# EAGLE design MotorDriver (EAGLE 9.7.0)
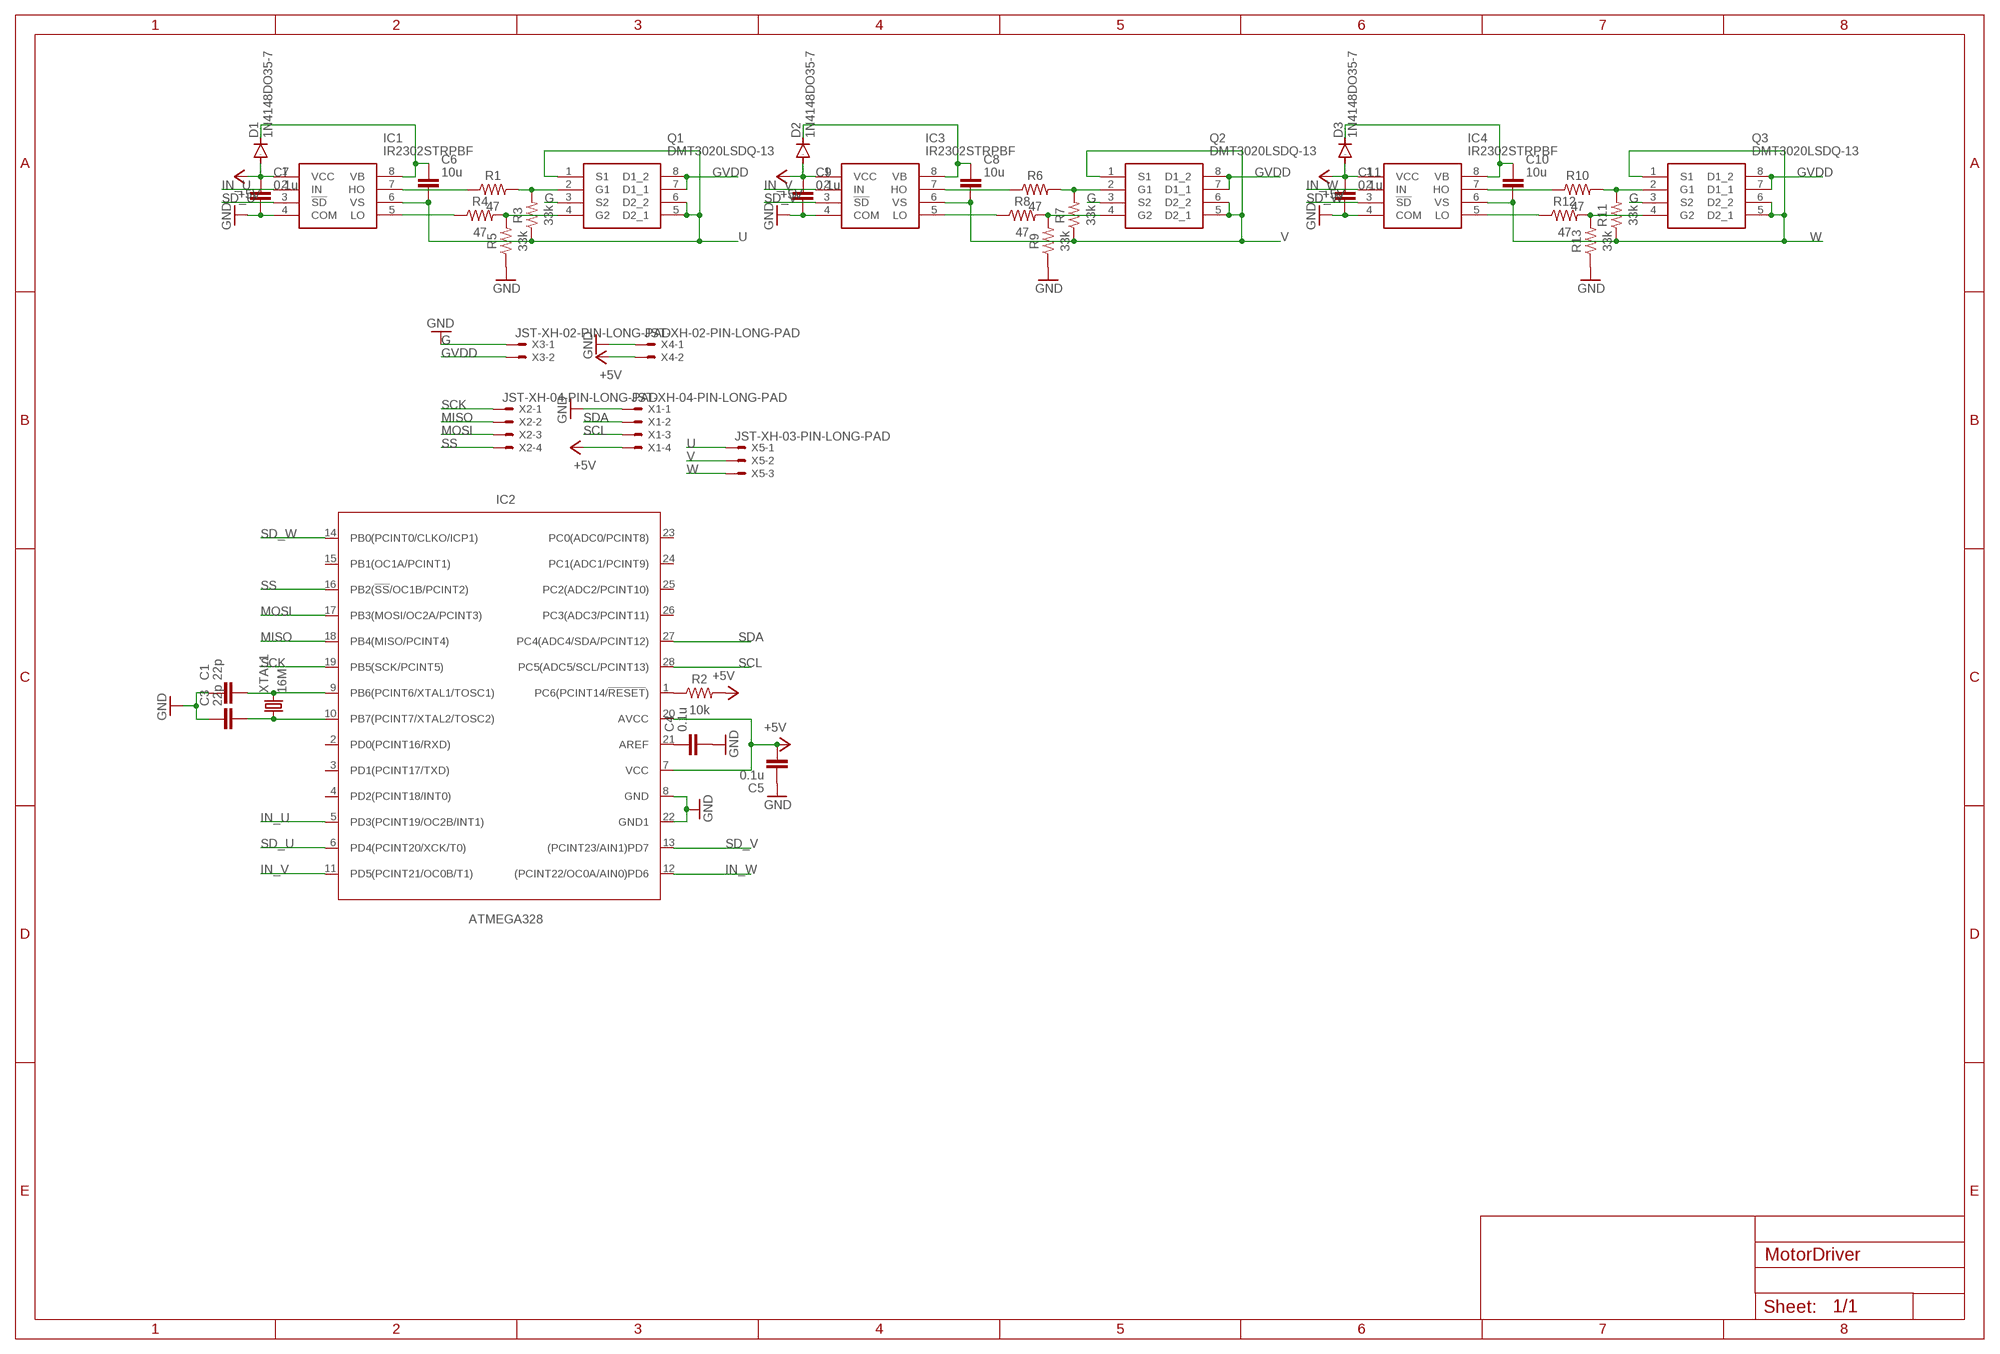
[diagram p0: schematic, sheet 1]

## Parts
C1  22p  C_CHIP-0603(1608-METRIC)  [CAPC1608X85]
C3  22p  C_CHIP-0603(1608-METRIC)  [CAPC1608X85]
C4  0.1u  C_CHIP-0603(1608-METRIC)  [CAPC1608X85]
C5  0.1u  C_CHIP-0603(1608-METRIC)  [CAPC1608X85]
C6  10u  C_CHIP-0603(1608-METRIC)  [CAPC1608X85]
C7  0.1u  C_CHIP-0603(1608-METRIC)  [CAPC1608X85]
C8  10u  C_CHIP-0603(1608-METRIC)  [CAPC1608X85]
C9  0.1u  C_CHIP-0603(1608-METRIC)  [CAPC1608X85]
C10  10u  C_CHIP-0603(1608-METRIC)  [CAPC1608X85]
C11  0.1u  C_CHIP-0603(1608-METRIC)  [CAPC1608X85]
D1  1N4148DO35-7  [DO35-7]
D2  1N4148DO35-7  [DO35-7]
D3  1N4148DO35-7  [DO35-7]
IC1  IR2302STRPBF  [SOIC127P600X175-8N]
IC2  ATMEGA328  ATMEGA328_DIP  [DIP1016W53P254L3467H457Q28B]
IC3  IR2302STRPBF  [SOIC127P600X175-8N]
IC4  IR2302STRPBF  [SOIC127P600X175-8N]
Q1  DMT3020LSDQ-13  [SOIC127P600X170-8N]
Q2  DMT3020LSDQ-13  [SOIC127P600X170-8N]
Q3  DMT3020LSDQ-13  [SOIC127P600X170-8N]
R1  47  R-US_CHIP-0603(1608-METRIC)  [RESC1608X60]
R2  10k  R-US_CHIP-0603(1608-METRIC)  [RESC1608X60]
R3  33k  R-US_CHIP-0603(1608-METRIC)  [RESC1608X60]
R4  47  R-US_CHIP-0603(1608-METRIC)  [RESC1608X60]
R5  33k  R-US_CHIP-0603(1608-METRIC)  [RESC1608X60]
R6  47  R-US_CHIP-0603(1608-METRIC)  [RESC1608X60]
R7  33k  R-US_CHIP-0603(1608-METRIC)  [RESC1608X60]
R8  47  R-US_CHIP-0603(1608-METRIC)  [RESC1608X60]
R9  33k  R-US_CHIP-0603(1608-METRIC)  [RESC1608X60]
R10  47  R-US_CHIP-0603(1608-METRIC)  [RESC1608X60]
R11  33k  R-US_CHIP-0603(1608-METRIC)  [RESC1608X60]
R12  47  R-US_CHIP-0603(1608-METRIC)  [RESC1608X60]
R13  33k  R-US_CHIP-0603(1608-METRIC)  [RESC1608X60]
X1  JST-XH-04-PIN-LONG-PAD  [JST-XH-04-PACKAGE-LONG-PAD]
X2  JST-XH-04-PIN-LONG-PAD  [JST-XH-04-PACKAGE-LONG-PAD]
X3  JST-XH-02-PIN-LONG-PAD  [JST-XH-02-PACKAGE-LONG-PAD]
X4  JST-XH-02-PIN-LONG-PAD  [JST-XH-02-PACKAGE-LONG-PAD]
X5  JST-XH-03-PIN-LONG-PAD  [JST-XH-03-PACKAGE-LONG-PAD]
XTAL1  16M  CRYSTAL_HC49-11.5L  [XTALRR488W45L1150T500H350B]

## Nets
+5V: C5.2 C7.1 C9.1 C11.1 D1.A D2.A D3.A IC1.1(VCC) IC2.7(VCC) IC2.20(AVCC) IC3.1(VCC) IC4.1(VCC) R2.2 X1.4 X4.2
G [power]: Q1.3(S2) Q2.3(S2) Q3.3(S2) X3.1 ; supply symbol labelled GND
GND: C1.1 C3.1 C4.2 C5.1 C7.2 C9.2 C11.2 IC1.4(COM) IC2.8(GND) IC2.22(GND1) IC3.4(COM) IC4.4(COM) R5.1 R9.1 R13.1 X1.1 X4.1
GVDD [power]: Q1.7(D1_1) Q1.8(D1_2) Q2.7(D1_1) Q2.8(D1_2) Q3.7(D1_1) Q3.8(D1_2) X3.2
IN_U: IC1.2(IN) IC2.5(PD3(PCINT19/OC2B/INT1))
IN_V: IC2.11(PD5(PCINT21/OC0B/T1)) IC3.2(IN)
IN_W: IC2.12((PCINT22/OC0A/AIN0)PD6) IC4.2(IN)
MISO: IC2.18(PB4(MISO/PCINT4)) X2.2
MOSI: IC2.17(PB3(MOSI/OC2A/PCINT3)) X2.3
N$1: C1.2 IC2.9(PB6(PCINT6/XTAL1/TOSC1)) XTAL1.2
N$2: C3.2 IC2.10(PB7(PCINT7/XTAL2/TOSC2)) XTAL1.1
N$3: IC2.1(PC6(PCINT14/!RESET!)) R2.1
N$4: C4.1 IC2.21(AREF)
N$5: C6.1 D1.C IC1.8(VB)
N$7: IC1.7(HO) R1.1
N$8: Q1.2(G1) R1.2 R3.2
N$9: Q1.4(G2) R4.2 R5.2
N$10: IC1.5(LO) R4.1
N$11: C8.1 D2.C IC3.8(VB)
N$13: IC3.7(HO) R6.1
N$14: Q2.2(G1) R6.2 R7.2
N$15: Q2.4(G2) R8.2 R9.2
N$16: IC3.5(LO) R8.1
N$17: C10.1 D3.C IC4.8(VB)
N$19: IC4.7(HO) R10.1
N$20: Q3.2(G1) R10.2 R11.2
N$21: Q3.4(G2) R12.2 R13.2
N$22: IC4.5(LO) R12.1
SCK: IC2.19(PB5(SCK/PCINT5)) X2.1
SCL: IC2.28(PC5(ADC5/SCL/PCINT13)) X1.3
SD_U: IC1.3(!SD) IC2.6(PD4(PCINT20/XCK/T0))
SD_V: IC2.13((PCINT23/AIN1)PD7) IC3.3(!SD)
SD_W: IC2.14(PB0(PCINT0/CLKO/ICP1)) IC4.3(!SD)
SDA: IC2.27(PC4(ADC4/SDA/PCINT12)) X1.2
SS: IC2.16(PB2(!SS!/OC1B/PCINT2)) X2.4
U [motor]: C6.2 IC1.6(VS) Q1.1(S1) Q1.5(D2_1) Q1.6(D2_2) R3.1 X5.1
V [motor]: C8.2 IC3.6(VS) Q2.1(S1) Q2.5(D2_1) Q2.6(D2_2) R7.1 X5.2
W [motor]: C10.2 IC4.6(VS) Q3.1(S1) Q3.5(D2_1) Q3.6(D2_2) R11.1 X5.3
Unconnected: IC2.2(PD0(PCINT16/RXD)) IC2.3(PD1(PCINT17/TXD)) IC2.4(PD2(PCINT18/INT0)) IC2.15(PB1(OC1A/PCINT1)) IC2.23(PC0(ADC0/PCINT8)) IC2.24(PC1(ADC1/PCINT9)) IC2.25(PC2(ADC2/PCINT10)) IC2.26(PC3(ADC3/PCINT11))

## Library data of the parts
C1 C3-C11 = Capacitor:C: Capacitor - Generic; CATEGORY: Capacitor
D1-D3 = diode:1N4148: DIODE high speed (Philips)
IC1 IC3 IC4 = IR2302STRPBF:IR2302STRPBF: Gate Drivers Hlf Brdg Drvr Soft T rn On Sngl 500ns Source: Datasheet <https://www.infineon.com/dgdl/Infineon-IR2302-DataSheet-v01_00-EN.pdf?fileId=5546d462533600a4015355c988b216de>; DESCRIPTION: Gate Drivers Hlf Brdg Drvr Soft T rn On Sngl 500ns; HEIGHT: 1.75mm; MANUFACTURER_NAME: Infineon; MANUFACTURER_PART_NUMBER: IR2302STRPBF; MOUSER_PART_NUMBER: 942-IR2302STRPBF; MOUSER_PRICE-STOCK: https://www.mouser.co.uk/ProductDetail/Infineon-IR/IR2302STRPBF?qs=2r01AXMCG3Pq9eYgEWJCIg%3D%3D
IC2 = IC_Embedded:ATMEGA328: 8-bit AVR Microcontroller with 32K Bytes In-System Programmable Flash Datasheet <http://ww1.microchip.com/downloads/en/DeviceDoc/ATmega48A-PA-88A-PA-168A-PA-328-P-DS-DS40002061A.pdf>; CATEGORY: IC_Embedded; MANUFACTURER: Microchip Technologies; MPN: ATmega328-PN; OPERATING_TEMP: –40 to +105°C; PART_STATUS: Active; SUB-CATEGORY: Microcontroller
Q1-Q3 = DMT3020LSDQ-13:DMT3020LSDQ-13: MOSFET MOSFET BVDSS: 8V 24V SO-8 T&R 2.5K Source: Datasheet <https://www.diodes.com/assets/Datasheets/DMT3020LSDQ.pdf>; DESCRIPTION: MOSFET MOSFET BVDSS: 8V 24V SO-8 T&R 2.5K; HEIGHT: 1.7mm; MANUFACTURER_NAME: Diodes Inc.; MANUFACTURER_PART_NUMBER: DMT3020LSDQ-13; MOUSER_PART_NUMBER: 621-DMT3020LSDQ-13; MOUSER_PRICE-STOCK: https://www.mouser.co.uk/ProductDetail/Diodes-Incorporated/DMT3020LSDQ-13?qs=Cb2nCFKsA8rthxKmUbYESA%3D%3D
R1-R13 = Resistor:R-US: Resistor Fixed - ANSI; CATEGORY: Resistor; SUB-CATEGORY: Fixed
X1 X2 = Rembrandt Electronics - JST XH Connectors v1-0:JST-XH-04-PIN: JST XH Connector 2 Pin Wire to board connector. Pitch: 2,54 mm, (0.100") Number of pins: 4 Created by Rembrandt Electronics www.rembrandtelectronics.com
X3 X4 = Rembrandt Electronics - JST XH Connectors v1-0:JST-XH-02-PIN: JST XH Connector 2 Pin Wire to board connector. Pitch: 2,54 mm, (0.100") Number of pins: 2 Created by Rembrandt Electronics www.rembrandtelectronics.com
X5 = Rembrandt Electronics - JST XH Connectors v1-0:JST-XH-03-PIN: JST XH Connector 2 Pin Wire to board connector. Pitch: 2,54 mm, (0.100") Number of pins: 3 Created by Rembrandt Electronics www.rembrandtelectronics.com
XTAL1 = Frequency-Source:CRYSTAL: Crystal 2Pin - Generic; CATEGORY: Frequency-Source; SUB-CATEGORY: Crystal-2Pin; VALUE: HC49

## Net classes
1 power: width 1.016 mm
2 motor: width 0.762 mm

## Board
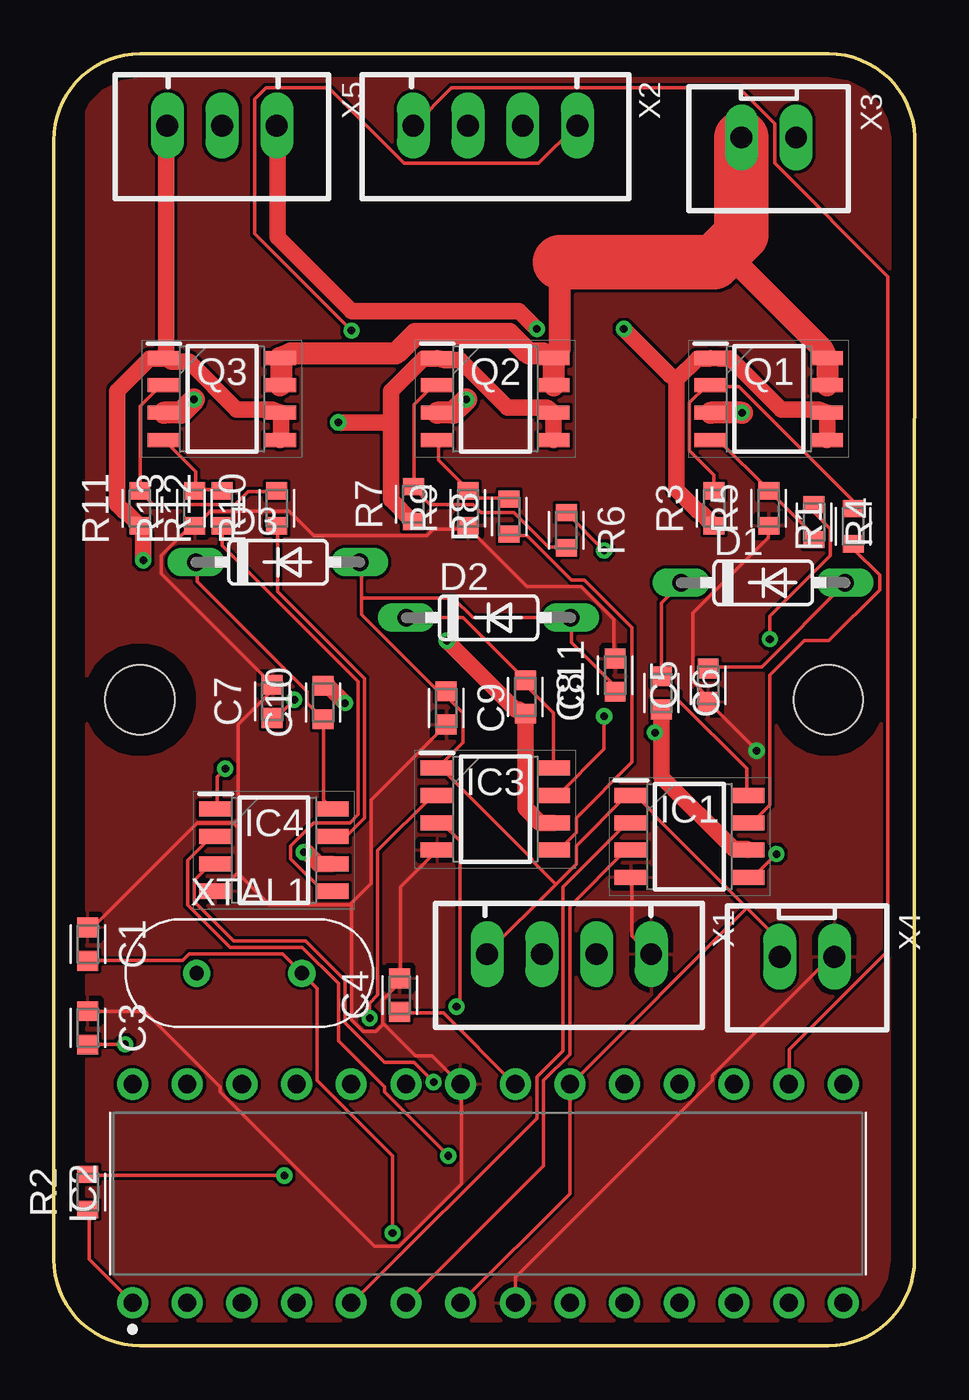
[diagram p1: board, top side]
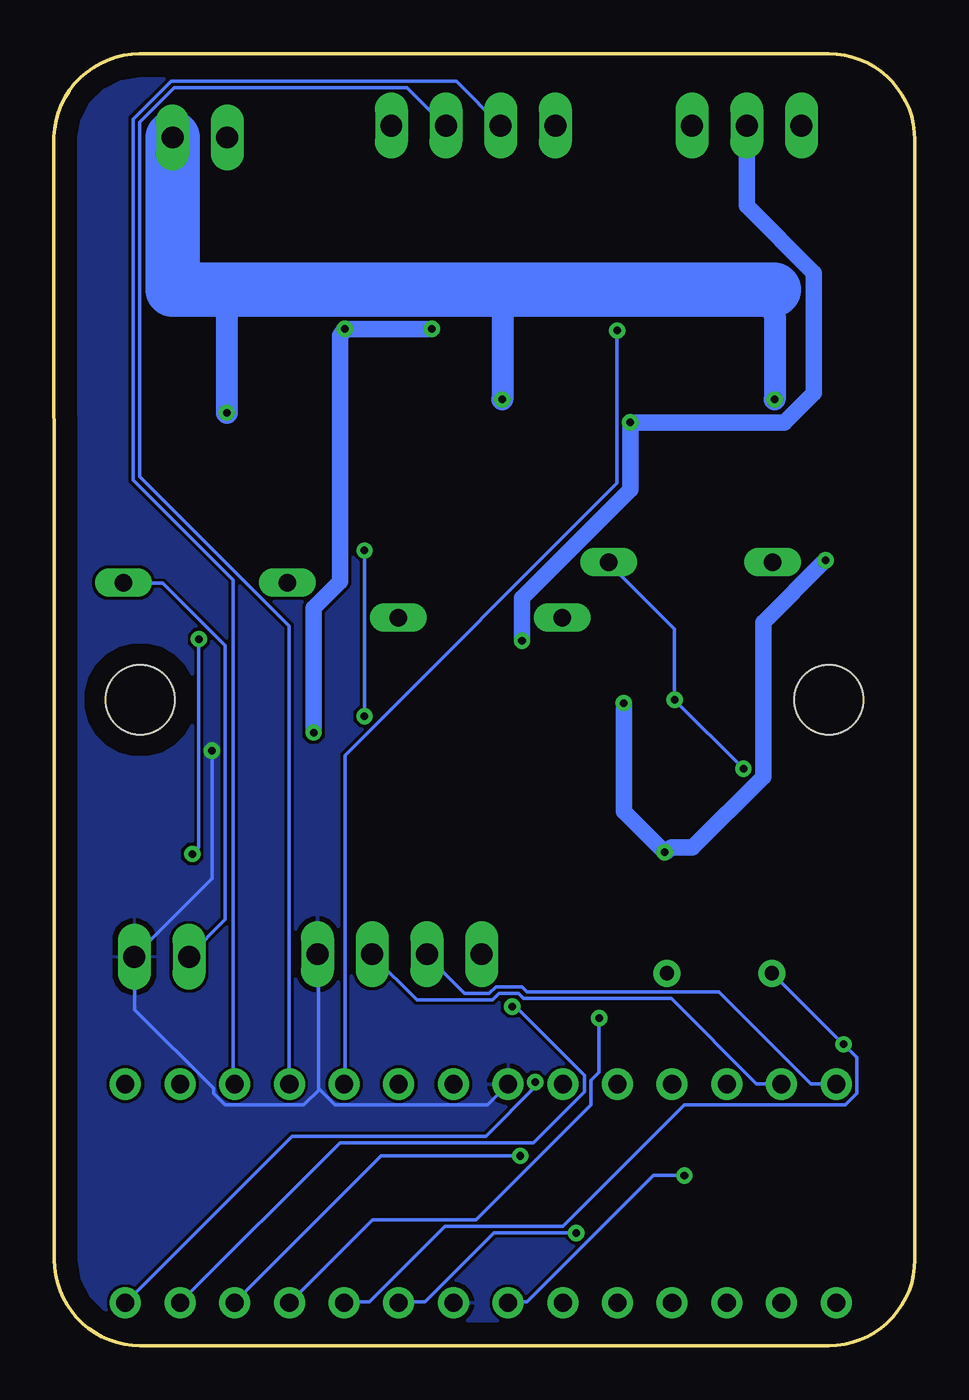
[diagram p2: board, bottom side, seen from below]

Size 40 x 60 mm. Coordinates in mm from the lower left corner, seen from the top.
Outline: 39.98,30 40,56.15 arc88 36,60 4,60 arc90 0,56 0,4 arc90 4,0 35.98,0 arc90 39.98,4 39.98,30
Copper layers (1*16): Top 0.035mm / dielectric 1.5mm / Bottom 0.035mm
Design rules "default": minimum track width 6mil, minimum drill 0.35mm, track to track 6mil, track to pad 6mil, pad to pad 6mil, via to via 6mil, smd to smd 6mil, copper to edge 40mil, drill to drill 6mil, minimum pad ring 10mil, minimum via ring 8mil, stop-mask expansion 4mil, vias tented up to drill 0mil, thermal gap 10mil
Holes 3.2 mm at 4,30 35.98,30

### Footprints (pad centres in the part's own frame; a part is rotated, then mirrored left to right if it is on the bottom)
CAPC1608X85 = smd 0.921 x 0.97: 1 -0.775,0; 2 0.775,0
DO35-7 = drill 0.813 long: A 3.81,0; C -3.81,0
SOIC127P600X175-8N = smd 1.525 x 0.7: 1 -2.712,1.905; 2 -2.712,0.635; 3 -2.712,-0.635; 4 -2.712,-1.905; 5 2.712,-1.905; 6 2.712,-0.635; 7 2.712,0.635; 8 2.712,1.905
DIP1016W53P254L3467H457Q28B = drill 0.841 pad 1.441: 1 -5.08,16.51; 2 -5.08,13.97; 3 -5.08,11.43; 4 -5.08,8.89; 5 -5.08,6.35; 6 -5.08,3.81; 7 -5.08,1.27; 8 -5.08,-1.27; 9 -5.08,-3.81; 10 -5.08,-6.35; 11 -5.08,-8.89; 12 -5.08,-11.43; 13 -5.08,-13.97; 14 -5.08,-16.51; 15 5.08,-16.51; 16 5.08,-13.97; 17 5.08,-11.43; 18 5.08,-8.89; 19 5.08,-6.35; 20 5.08,-3.81; 21 5.08,-1.27; 22 5.08,1.27; 23 5.08,3.81; 24 5.08,6.35; 25 5.08,8.89; 26 5.08,11.43; 27 5.08,13.97; 28 5.08,16.51
SOIC127P600X170-8N = smd 1.5 x 0.65: 1 -2.7,1.905; 2 -2.7,0.635; 3 -2.7,-0.635; 4 -2.7,-1.905; 5 2.7,-1.905; 6 2.7,-0.635; 7 2.7,0.635; 8 2.7,1.905
RESC1608X60 = smd 0.799 x 0.974: 1 -0.815,0; 2 0.815,0
JST-XH-04-PACKAGE-LONG-PAD = drill 1.016 long: 1 -3.81,0; 2 -1.27,0; 3 1.27,0; 4 3.81,0
JST-XH-02-PACKAGE-LONG-PAD = drill 1.016 long: 1 -1.27,0; 2 1.27,0
JST-XH-03-PACKAGE-LONG-PAD = drill 1.016 long: 1 -2.54,0; 2 0,0; 3 2.54,0
XTALRR488W45L1150T500H350B = drill 0.657 pad 1.257: 1 -2.44,0; 2 2.44,0

### Placement (x,y rotation side)
C1  1.58,18.65 270 top
C3  1.58,14.76 270 top
C4  16.06,16.28 90 top
C5  30.39,30.67 90 top
C6  28.22,30.31 270 top
C7  10.15,29.92 90 top
C8  21.91,30.13 270 top
C9  18.22,29.62 270 top
C10  12.51,29.87 90 top
C11  26.08,31.14 90 top
D1  32.96,35.44 0 top
D2  20.19,33.81 0 top
D3  10.41,36.39 0 top
IC1  29.53,23.65 0 top
IC2  20.17,7.07 90 top
IC3  20.51,24.92 0 top
IC4  10.22,23.02 0 top
Q1  33.21,43.97 0 top
Q2  20.51,43.97 0 top
Q3  7.81,43.97 0 top
R1  37.13,38.06 90 top
R2  1.58,7.14 90 top
R3  30.67,38.89 90 top
R4  35.31,38.26 270 top
R5  33.21,38.89 90 top
R6  23.81,37.87 270 top
R7  16.7,39.08 90 top
R8  21.14,38.51 90 top
R9  19.24,38.89 90 top
R10  10.35,38.89 90 top
R11  4,38.89 90 top
R12  7.81,38.89 90 top
R13  6.54,38.89 90 top
X1  23.94,18.18 180 top
X2  20.51,56.67 180 top
X3  33.21,56.11 180 top
X4  34.99,18.06 180 top
X5  7.81,56.67 180 top
XTAL1  9.08,17.3 0 top

### Tracks (layer width: path | path; a pad name or v marks a point on that pad's centre or on a via)
+5V  (via drill 0.35)
  Top 0.152: v10.71,7.9 1.64,7.9 R2.2 | IC2.7 18.94,2.04 23.96,7.06 23.96,12.09 IC2.20 24.04,12.17 32.19,20.32 | C11.1 26.02,30.38 26.02,30.69 24.04,32.67 24.04,33.81 D2.A 19.47,33.81 18.55,34.72 14.29,34.72 | v11.16,30 10.32,29.16 10.17,29.16 C7.1 | v7.96,26.8 7.58,26.42 7.58,24.97 IC4.1 | 14.29,34.72 14.29,36.33 D3.A | 14.29,34.72 14.29,33.96 17.79,30.46 18.17,30.46 C9.1 18.25,30.38 18.25,30.15 19.01,29.39 19.01,28.02 17.87,26.88 IC3.1 17.95,26.88 22.21,22.61 22.21,22.53 23.32,21.43 | C5.2 30.44,31.52 32.88,31.52 36.77,35.41 D1.A | 23.32,21.43 20.08,18.19 X1.4 | 23.32,21.43 24.27,22.38 24.27,23.22 26.55,25.5 26.78,25.5 IC1.1 26.86,25.5 27.09,25.5 27.85,24.74 27.85,24.67 32.19,20.32 | X4.2 33.72,18.8 32.19,20.32
  Bottom 0.152: v10.71,7.9 12.15,7.9 18.02,2.04 18.86,2.04 IC2.7 | D3.A 14.21,36.33 11.16,33.28 v11.16,30 v7.96,26.8 | D1.A 36.77,35.41 34.94,35.41 32.04,32.52 32.04,19.79 33.72,18.11 X4.2
G  (via drill 0.35)
  Top 1.016: Q3.3 5.91,43.34 v6.52,43.95 | Q2.3 18.55,43.34 v19.16,43.95 | v31.96,43.34 Q1.3
  Bottom 1.016: v6.52,43.95 6.52,47.83 6.54,49.05 | 19.16,49.05 v19.16,43.95 | 31.96,49.05 v31.96,43.34
  Bottom 2.54: X3.1 34.48,49.05 31.96,49.05 19.16,49.05 6.54,49.05
GND  (via drill 0.35)
  Top 0.152: R5.1 33.19,38 33.19,37.54 29.68,34.04 29.68,30.84 30.36,30.15 30.36,29.92 C5.1 30.44,29.85 v32.65,27.64 | IC2.8 21.45,2.04 21.45,3.18 30.59,12.32 30.59,12.55 36.08,18.04 36.23,18.04 X4.1 | C11.2 26.02,31.98 26.02,33.73 24.5,35.26 21.98,35.26 19.24,38 R9.1 19.24,37.92 17.64,37.92 17.34,37.62 12.08,37.62 10.93,38.76 7.28,38.76 6.59,38.08 R13.1 6.52,38 6.29,38 4.99,36.71 4.99,35.87 10.1,30.76 C7.2 10.1,30.69 10.1,30.38 8.57,28.86 8.57,24.44 8.38,24.25 | 8.38,24.25 8.57,24.06 8.57,22 8.53,21.96 | 8.38,24.25 8.34,24.29 6.67,24.29 1.87,19.48 1.64,19.48 C1.1 | 8.53,21.96 7.73,21.16 7.58,21.16 IC4.4 | 13.79,20.51 13.75,20.48 10.02,20.48 8.53,21.96 | 13.79,20.51 14.74,21.47 14.74,25.35 18.17,28.78 C9.2 | IC1.4 26.86,21.69 26.86,19.03 27.7,18.19 X1.1 | IC3.4 17.79,22.99 16.12,21.31 16.12,17.12 C4.2 16.04,17.05 16.04,16.82 15.28,16.05 15.28,14.99 15.32,14.95 | C3.1 1.64,15.52 4.23,15.52 7.73,12.02 7.73,11.79 14.9,4.62 16.04,4.62 18.94,7.52 18.94,12.09 IC2.22 18.86,12.17 17.56,13.46 16.8,13.46 15.32,14.95 | 15.32,14.95 14.97,14.61 14.36,14.61 13.83,15.14 13.83,20.48 13.79,20.51
  Bottom 0.152: v32.65,27.64 32.65,21.69 36.23,18.11 X4.1 36.23,18.04 36.23,15.6 32.58,11.94 32.58,11.71 32.04,11.18 28.38,11.18 27.66,11.9 | 27.66,11.9 26.94,11.18 19.85,11.18 18.94,12.09 IC2.22 | 27.66,11.9 27.7,11.94 27.7,18.11 X1.1
  pour Bottom: 2.73,59.21 37.02,59.21 39.56,56.67 39.56,3.33 37.02,0.79 2.73,0.79 2.73,2.06 1.46,3.33 1.46,57.94
  pour Top: 2.73,59.21 1.46,57.94 1.46,3.33 2.73,2.06 2.73,0.79 37.02,0.79 39.56,3.33 39.56,56.67 37.02,59.21
GVDD
  Top 1.016: 35.93,45.85 35.93,44.63 Q1.7 | 35.93,45.85 Q1.8 | 31.18,50.83 35.7,46.31 35.93,45.85 | Q3.7 10.55,44.63 10.55,45.85 Q3.8 11.01,46.08 15.89,46.08 16.8,46.99 21.14,46.99 22.06,46.08 22.75,46.08 Q2.8 | Q2.7 23.2,44.63 23.2,45.85 Q2.8 | 23.51,50.32 23.51,46.31 Q2.8
  Top 2.54: X3.2 31.94,51.59 31.18,50.83 30.67,50.32 23.51,50.32
IN_U
  Top 0.152: IC1.2 26.63,24.29 23.66,21.31 23.66,13.69 22.44,12.47 22.44,10.57 13.83,1.96 IC2.5
IN_V  (via drill 0.35)
  Top 0.152: v14.67,15.22 14.67,15.9 15.05,16.28 15.05,22.99 17.56,25.5 17.79,25.5 IC3.2
  Bottom 0.152: v14.67,15.22 14.67,12.7 15.05,12.32 15.05,11.18 20.38,5.84 25.18,5.84 28.99,2.04 IC2.11
IN_W  (via drill 0.35)
  Top 0.152: v18.33,8.82 15.35,11.79 15.35,12.02 13.22,14.15 13.22,16.82 11.54,18.49 8.19,18.49 6.21,20.48 6.21,22.53 7.28,23.6 7.5,23.6 IC4.2
  Bottom 0.152: v18.33,8.82 24.8,8.82 31.58,2.04 IC2.12
MISO
  Bottom 0.152: IC2.18 29.07,12.17 29.07,33.43 36,40.36 36,56.82 34.4,58.42 23.58,58.42 21.83,56.67 X2.2
MOSI
  Bottom 0.152: X2.3 21.3,58.73 34.56,58.73 36.31,56.98 36.31,40.21 31.66,35.56 31.66,12.17 IC2.17
N$1  (via drill 0.35)
  Top 0.152: C1.2 1.64,17.88 5.98,17.88 6.29,18.19 10.63,18.19 11.47,17.35 XTAL1.2 11.54,17.27 12.23,16.59 12.23,12.32 15.73,8.82 v15.73,5.23
  Bottom 0.152: v15.73,5.23 19.55,5.23 22.75,2.04 23.96,2.04 IC2.9
N$2  (via drill 0.35)
  Top 0.152: v3.31,14 1.64,14 C3.2
  Bottom 0.152: XTAL1.1 6.59,17.27 v3.31,14 2.71,13.39 2.71,11.71 3.24,11.18 10.71,11.18 16.34,5.54 21.83,5.54 25.34,2.04 26.48,2.04 IC2.10
N$3
  Top 0.152: R2.1 1.64,6.3 1.64,4.02 3.62,2.04 IC2.1
N$4
  Top 0.152: C4.1 16.12,15.45 18.1,15.45 21.37,12.17 IC2.21
N$5
  Top 0.152: D1.C 29.15,35.41 28.23,34.5 28.23,31.14 C6.1 28.23,31.07 28.99,30.3 28.99,30 32.19,26.8 32.19,25.58 IC1.8
N$7
  Top 0.152: IC1.7 32.42,24.29 33.26,25.12 33.26,31.14 34.86,32.74 36,32.74 38.37,35.11 38.37,35.79 37.15,37.01 37.15,37.24 R1.1
N$8
  Top 0.152: R1.2 37.07,38.91 37.07,39.3 31.81,44.55 30.52,44.55 Q1.2 30.44,44.55 30.29,44.55 29.53,43.79 29.53,41.58 30.67,40.44 R3.2
N$9
  Top 0.152: R4.2 35.24,37.47 35.24,37.7 33.26,39.68 R5.2 33.19,39.75 30.9,42.04 30.52,42.04 Q1.4
N$10  (via drill 0.35)
  Top 0.152: v33.26,32.82 33.26,33.89 36.08,36.71 36.08,37.92 35.32,38.69 R4.1 | v33.57,22.84 32.5,21.77 32.27,21.77 IC1.5
  Bottom 0.152: v33.26,32.82 33.26,23.14 v33.57,22.84
N$11
  Top 0.152: IC3.8 23.2,26.88 23.2,29.39 21.91,30.69 C8.1 21.91,30.91 19.01,33.81 D2.C
N$13  (via drill 0.35)
  Top 0.152: v25.57,36.93 R6.1 | v25.57,29.24 25.57,27.71 23.43,25.58 23.28,25.58 IC3.7
  Bottom 0.152: v25.57,29.24 v25.57,36.93
N$14
  Top 0.152: R6.2 23.81,37.09 22.97,37.09 21.37,38.69 19.85,38.69 19.47,39.07 17.49,39.07 16.73,39.83 R7.2 16.73,39.91 16.73,43.72 17.56,44.55 17.79,44.55 Q2.2
N$15
  Top 0.152: R8.2 21.14,39.37 19.55,39.37 19.24,39.68 R9.2 19.24,39.75 17.87,41.12 17.87,42.04 Q2.4
N$16
  Top 0.152: R8.1 21.14,37.62 21.98,37.62 24.04,35.56 24.65,35.56 26.86,33.35 26.86,27.1 24.27,24.51 24.27,23.83 23.51,23.07 23.28,23.07 IC3.5
N$17
  Top 0.152: IC4.8 12.91,24.97 12.53,25.35 12.53,29.09 C10.1 12.46,29.16 11.77,29.85 11.77,30.38 6.67,35.49 6.67,36.33 D3.C
N$19
  Top 0.152: R10.1 10.4,38 10.4,35.03 14.44,30.99 14.44,24.51 13.6,23.68 12.99,23.68 IC4.7
N$20
  Top 0.152: Q3.2 5.07,44.55 4.91,44.55 4,43.64 R11.2 4,39.68 4.61,39.07 8.42,39.07 9.03,39.68 10.32,39.68 R10.2
N$21
  Top 0.152: R12.2 7.81,39.75 6.59,39.75 R13.2 6.59,39.83 6.59,40.59 5.14,42.04 Q3.4
N$22
  Top 0.152: R12.1 7.81,37.16 14.13,30.84 14.13,24.67 13.75,24.29 12.08,24.29 11.01,23.22 11.01,22.61 12.46,21.16 12.91,21.16 IC4.5
SCK  (via drill 0.35)
  Top 0.152: v13.83,47.14 9.33,51.64 9.33,57.89 9.87,58.42 12.76,58.42 16.27,54.92 22.52,54.92 24.27,56.67 X2.1
  Bottom 0.152: v13.83,47.14 13.83,40.06 26.48,27.41 26.48,12.17 IC2.19
SCL
  Bottom 0.152: IC2.28 3.69,12.17 4.84,12.17 9.11,16.44 18.02,16.44 18.25,16.66 19.47,16.66 19.77,16.36 20.92,16.36 22.67,18.11 X1.3
SD_U
  Top 0.152: IC1.3 26.78,22.99 26.55,22.99 23.96,20.4 23.96,13.54 22.75,12.32 22.75,8.36 16.42,2.04 IC2.6
SD_V  (via drill 0.35)
  Top 0.152: IC3.3 18.02,24.29 18.86,23.45 18.86,15.9 v18.71,15.75
  Bottom 0.152: v18.71,15.75 18.55,15.75 15.35,12.55 15.35,11.79 17.72,9.43 26.71,9.43 34.1,2.04 IC2.13
SD_W  (via drill 0.35)
  Top 0.152: IC4.3 7.28,22.38 6.52,21.62 6.52,20.63 8.34,18.8 11.7,18.8 13.53,16.97 13.53,14.99 15.35,13.16 16.73,13.16 v17.64,12.25
  Bottom 0.152: v17.64,12.25 17.64,12.02 19.93,9.73 28.92,9.73 36.61,2.04 IC2.14
SDA
  Bottom 0.152: IC2.27 6.21,12.17 7.35,12.17 11.32,16.13 18.17,16.13 18.4,16.36 19.32,16.36 19.62,16.05 23.13,16.05 25.18,18.11 X1.2
SS
  Top 0.152: IC2.16 34.17,12.17 34.17,13.77 38.75,18.34 38.75,49.66 33.49,54.92 33.49,56.75 31.81,58.42 18.48,58.42 16.73,56.67 X2.4
U  (via drill 0.35)
  Top 0.762: 28.23,28.48 28.23,26.42 31.58,23.07 32.19,23.07 IC1.6 | 28.23,28.48 28.23,29.47 C6.2 | Q1.5 35.93,42.12 35.93,43.34 Q1.6 35.55,43.49 33.79,43.49 31.43,45.85 30.9,45.85 Q1.1 30.44,45.85 29.91,45.85 28.92,44.86 | 28.92,44.86 28.92,39.75 29.91,38.76 29.98,38.76 R3.1 | v22.44,47.22 21.6,48.06 13.83,48.06 10.4,51.49 10.4,56.67 X5.1 | v26.48,47.22 28.61,45.09 28.92,44.86 | v27.93,28.48 28.23,28.48
  Bottom 0.762: v22.44,47.22 v26.48,47.22 26.71,46.92 26.71,35.49 27.93,34.27 v27.93,28.48
V  (via drill 0.35)
  Top 0.762: IC3.6 22.59,24.29 21.91,24.97 C8.2 21.6,29.54 21.45,29.54 v18.25,32.74 | Q2.5 23.2,42.12 Q2.6 22.9,43.56 21.07,43.56 18.86,45.77 18.17,45.77 Q2.1 17.79,45.85 17.18,45.85 15.66,44.33 15.66,42.88 | 15.66,42.88 15.66,39.3 16.65,38.31 R7.1 | 15.66,42.88 v13.22,42.88
  Bottom 0.762: X5.2 7.81,52.94 4.69,49.81 4.69,44.25 6.06,42.88 v13.22,42.88 13.22,39.75 18.25,34.72 v18.25,32.74
W  (via drill 0.35)
  Top 0.762: v13.53,29.85 12.76,30.61 12.53,30.61 C10.2 | v11.62,22.91 11.77,22.91 12.31,22.38 IC4.6 | Q3.5 10.55,42.12 10.55,43.34 Q3.6 10.17,43.49 8.5,43.49 6.29,45.7 5.45,45.7 Q3.1 | Q3.1 5.07,45.85 4.46,45.85 2.93,44.33 2.93,39.07 3.24,38.76 3.31,38.76 R11.1 4.15,37.7 v4.15,36.48 | X5.3 5.22,56.67 5.22,46.23 Q3.1
  Bottom 0.762: v13.53,29.85 13.53,24.82 v11.62,22.91 11.32,23.14 10.32,23.14 7.05,26.42 7.05,33.58 v4.15,36.48